# Altium schematic sheet LV25-P 380Vac ADC 센싱회로.SchDoc: 380Vac Sensing Circuit Used LV25-P
size A4
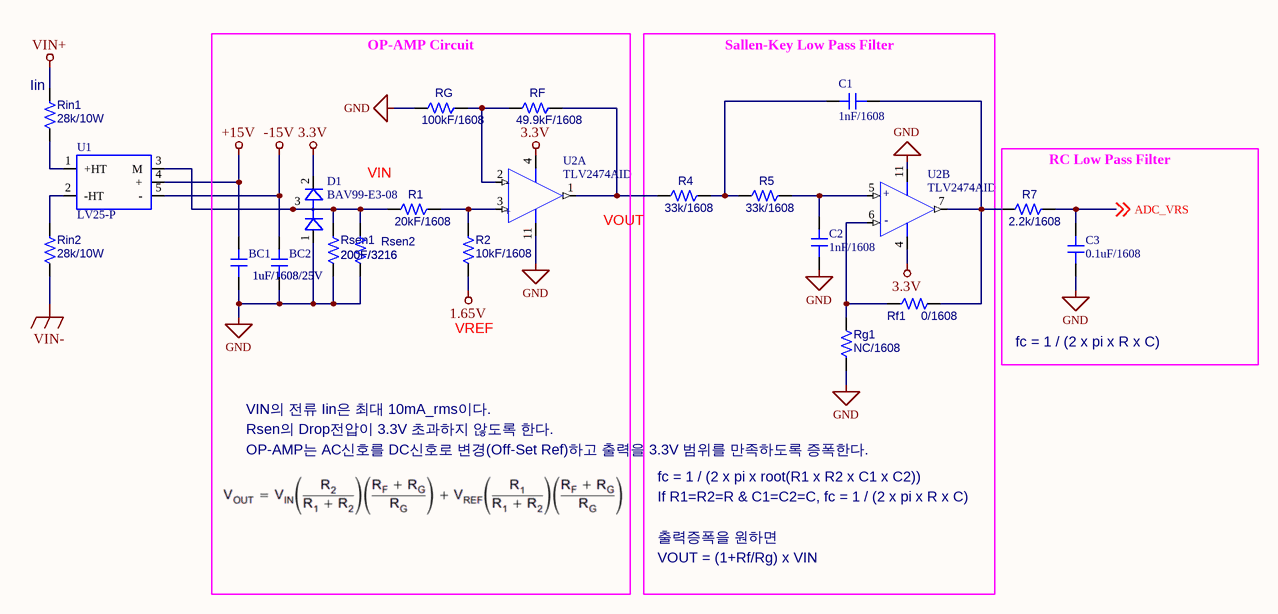
[diagram p0: LV25-P 380Vac ADC 센싱회로.SchDoc]

## Parts
BC1  1uF/1608/25V  [C-1608]
BC2  1uF/1608/25V  [C-1608]
C1  1nF/1608  [C-1608]
C2  1nF/1608  [C-1608]
C3  0.1uF/1608  [C-1608]
D1  BAV99-E3-08  [SOT-23]
R1  20kF/1608  [R-1608]
R2  10kF/1608  [R-1608]
R4  33k/1608  [R-1608]
R5  33k/1608  [R-1608]
R7  2.2k/1608  [R-1608]
RF  49.9kF/1608  [R-1608]
Rf1  0/1608  [R-1608]
RG  100kF/1608  [R-1608]
Rg1  NC/1608  [R-1608]
Rin1  28k/10W  [R-1608]
Rin2  28k/10W  [R-1608]
Rsen1  200F/3216  [R-1608]
Rsen2  200F/3216  [R-1608]
U1  LV25-P
U2  TLV2474AID  [SO-14]  (parts A,B of 4)

## Nets
1.65V: R2.2
3.3V: D1.2 U2.4(+VCC)
+15V: BC1.1 U1.4(+)
-15V: BC2.1 U1.5(-)
GND: BC1.2 BC2.2 C2.2 C3.2 D1.1 RG.2 Rg1.1 Rsen1.2 Rsen2.2 U2.11(-VCC)
VIN+: Rin1.1
VIN-: Rin2.2
ADC_VRS: C3.1 R7.1 ; off-sheet ADC_VRS
NetC1_1: C1.1 R4.1 R5.2
NetC1_2: C1.2 R7.2 Rf1.2 U2.7(OUT)
NetC2_1: C2.1 R5.1 U2.5(+IN)
NetD1_3: D1.3 R1.2 Rsen1.1 Rsen2.1 U1.3(M)
NetR1_1: R1.1 R2.1 U2.3(+IN)
NetR4_2: R4.2 RF.1 U2.1(OUT)
NetRf1_1: Rf1.1 Rg1.2 U2.6(-IN)
NetRF_2: RF.2 RG.1 U2.2(-IN)
NetRin1_2: Rin1.2 U1.1(+HT)
NetRin2_1: Rin2.1 U1.2(-HT)

## Notes on the sheet
- (near Rin1) Iin
- OP-AMP Circuit
- (near C1) Sallen-Key Low Pass Filter
- (near R1) VIN
- VOUT
- (near R7) RC Low Pass Filter
- VREF
- fc = 1 / (2 x pi x R x C)
- VIN의 전류 Iin은 최대 10mA_rms이다.
- Rsen의 Drop전압이 3.3V 초과하지 않도록 한다.
- OP-AMP는 AC신호를 DC신호로 변경(Off-Set Ref)하고 출력을 3.3V 범위를 만족하도록 증폭한다.
- fc = 1 / (2 x pi x root(R1 x R2 x C1 x C2))
- If R1=R2=R & C1=C2=C, fc = 1 / (2 x pi x R x C)
- 출력증폭을 원하면
- VOUT = (1+Rf/Rg) x VIN
- PJT No
- This drawing is the property of SysInTeck.
- The information contained thereon may not be used
- or the drawing reproduced without written permission
- from SysInTeck.
- 이 도면은 시스인텍의 지적자산입니다. 따라서 시스인텍의 동의 없이
- 본 회로의 전체  또는 일부를 발취하여 사용하는 행위는 위법임을
- 알려드립니다.
- DrawnBy
- CheckedBy
- PCB No.
- Title
- Size
- A4
- DocumentNumber
- SysInTeck
- Rev
- BOM No.
- Date
- Sheet
- of
- (in symbol OPA4336_1, part A) -; +
- (in symbol OPA4336_1, part B) +; -

## Library data of the parts
BC1 BC2 C1-C3 = CAPACITOR NON-POL_1: PCB Footprint: C-1608
D1 = BAV99-E3-08: DIODE ARRAY GP 70V 150MA SOT23
R1 R2 R4 R5 R7 RF Rf1 RG Rg1 Rin1 Rin2 Rsen1 Rsen2 = R_Dup1: OriginalSymbolOrigin: (0,0); PSpiceTemplate: R^@REFDES %1 %2 ?TOLERANCE|R^@REFDES| @VALUE  ?TOLERANCE|\n.model R^@REFDES RES R=1 DEV=@TOLERANCE%|; Value: 6.98kF/1608; PCB Footprint: R-1608
U2 = OPA4336_1: PCB Footprint: SO-14